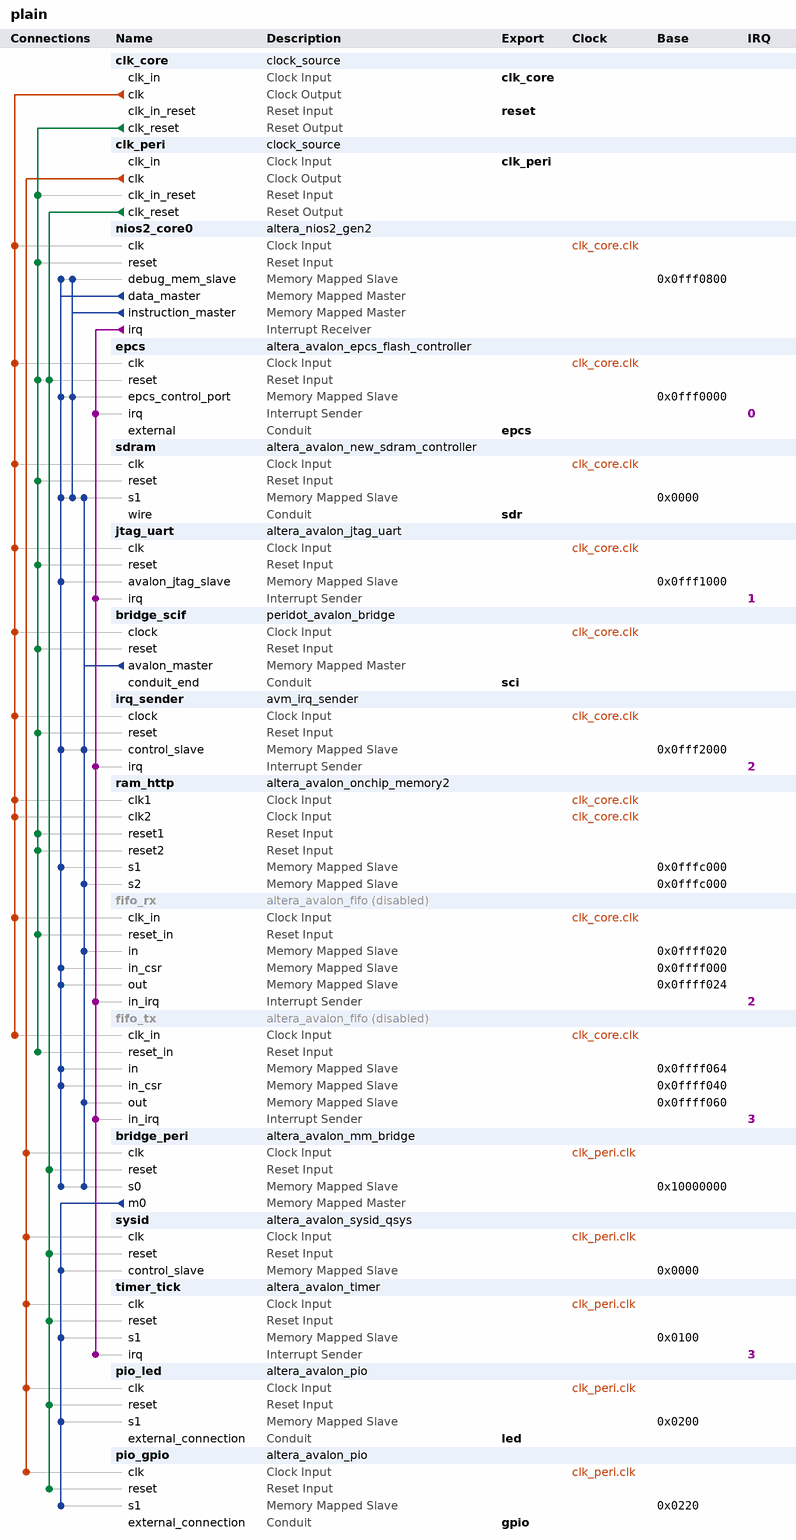
[diagram p0: system contents]
# Platform Designer (Qsys) system plain, Cyclone IV E EP4CE6E22C8
# Parameters at their usual value, and those the tool derives, are not listed.
package require -exact qsys 14.1
create_system plain
set_project_property DEVICE_FAMILY {Cyclone IV E}
set_project_property DEVICE EP4CE6E22C8

add_instance clk_core clock_source 14.1
set_instance_parameter_value clk_core clockFrequency 100000000

add_instance clk_peri clock_source 14.1
set_instance_parameter_value clk_peri clockFrequency 40000000

add_instance nios2_core0 altera_nios2_gen2 14.1
set_instance_parameter_value nios2_core0 dcache_size 0
set_instance_parameter_value nios2_core0 exceptionSlave sdram.s1
set_instance_parameter_value nios2_core0 icache_size 8192
set_instance_parameter_value nios2_core0 impl Fast
set_instance_parameter_value nios2_core0 resetSlave epcs.epcs_control_port
set_instance_parameter_value nios2_core0 setting_activateTrace true
set_instance_parameter_value nios2_core0 setting_branchpredictiontype Static

add_instance epcs altera_avalon_epcs_flash_controller 14.1
set_instance_parameter_value epcs autoSelectASMIAtom false
set_instance_parameter_value epcs resetrequest_enabled true

add_instance sdram altera_avalon_new_sdram_controller 14.1
set_instance_parameter_value sdram TAC 6.0
set_instance_parameter_value sdram TRCD 20.0
set_instance_parameter_value sdram TRFC 67.5
set_instance_parameter_value sdram TRP 20.0
set_instance_parameter_value sdram TWR 15.0
set_instance_parameter_value sdram casLatency 2
set_instance_parameter_value sdram columnWidth 8
set_instance_parameter_value sdram dataWidth 16
set_instance_parameter_value sdram generateSimulationModel false
set_instance_parameter_value sdram initRefreshCommands 8
set_instance_parameter_value sdram model single_Micron_MT48LC4M32B2_7_chip
set_instance_parameter_value sdram numberOfBanks 4
set_instance_parameter_value sdram numberOfChipSelects 1
set_instance_parameter_value sdram powerUpDelay 200.0
set_instance_parameter_value sdram refreshPeriod 15.625
set_instance_parameter_value sdram rowWidth 12

add_instance jtag_uart altera_avalon_jtag_uart 14.1
set_instance_parameter_value jtag_uart simInteractiveOptions NO_INTERACTIVE_WINDOWS

add_instance bridge_scif peridot_avalon_bridge 0.9

add_instance irq_sender avm_irq_sender 1.0
set_instance_parameter_value irq_sender IRQ_WIDTH 1

add_instance ram_http altera_avalon_onchip_memory2 14.1
set_instance_parameter_value ram_http dataWidth 32
set_instance_parameter_value ram_http dualPort true
set_instance_parameter_value ram_http initMemContent false
set_instance_parameter_value ram_http initializationFileName onchip_mem.hex
set_instance_parameter_value ram_http memorySize 2048
set_instance_parameter_value ram_http resetrequest_enabled false

add_instance fifo_rx altera_avalon_fifo 14.1
set_instance_property fifo_rx ENABLED false
set_instance_parameter_value fifo_rx bitsPerSymbol 16
set_instance_parameter_value fifo_rx channelWidth 8
set_instance_parameter_value fifo_rx errorWidth 8
set_instance_parameter_value fifo_rx fifoDepth 256
set_instance_parameter_value fifo_rx fifoInputInterfaceOptions AVALONMM_WRITE
set_instance_parameter_value fifo_rx fifoOutputInterfaceOptions AVALONMM_READ
set_instance_parameter_value fifo_rx singleClockMode true
set_instance_parameter_value fifo_rx symbolsPerBeat 2
set_instance_parameter_value fifo_rx useIRQ true
set_instance_parameter_value fifo_rx usePacket true
set_instance_parameter_value fifo_rx useReadControl false

add_instance fifo_tx altera_avalon_fifo 14.1
set_instance_property fifo_tx ENABLED false
set_instance_parameter_value fifo_tx bitsPerSymbol 16
set_instance_parameter_value fifo_tx channelWidth 8
set_instance_parameter_value fifo_tx errorWidth 8
set_instance_parameter_value fifo_tx fifoDepth 256
set_instance_parameter_value fifo_tx fifoInputInterfaceOptions AVALONMM_WRITE
set_instance_parameter_value fifo_tx fifoOutputInterfaceOptions AVALONMM_READ
set_instance_parameter_value fifo_tx singleClockMode true
set_instance_parameter_value fifo_tx symbolsPerBeat 2
set_instance_parameter_value fifo_tx useIRQ true
set_instance_parameter_value fifo_tx usePacket true
set_instance_parameter_value fifo_tx useReadControl false

add_instance bridge_peri altera_avalon_mm_bridge 14.1
set_instance_parameter_value bridge_peri ADDRESS_UNITS SYMBOLS
set_instance_parameter_value bridge_peri ADDRESS_WIDTH 10
set_instance_parameter_value bridge_peri DATA_WIDTH 32
set_instance_parameter_value bridge_peri MAX_PENDING_RESPONSES 4
set_instance_parameter_value bridge_peri USE_AUTO_ADDRESS_WIDTH 1

add_instance sysid altera_avalon_sysid_qsys 14.1
set_instance_parameter_value sysid id 538185769

add_instance timer_tick altera_avalon_timer 14.1
set_instance_parameter_value timer_tick period 1
set_instance_parameter_value timer_tick periodUnits MSEC

add_instance pio_led altera_avalon_pio 14.1
set_instance_parameter_value pio_led bitModifyingOutReg true
set_instance_parameter_value pio_led direction Output
set_instance_parameter_value pio_led width 1

add_instance pio_gpio altera_avalon_pio 14.1
set_instance_parameter_value pio_gpio bitModifyingOutReg true
set_instance_parameter_value pio_gpio direction Bidir
set_instance_parameter_value pio_gpio width 28

# connections
add_connection clk_core.clk bridge_scif.clock clock
add_connection clk_core.clk epcs.clk clock
add_connection clk_core.clk fifo_rx.clk_in clock
add_connection clk_core.clk fifo_tx.clk_in clock
add_connection clk_core.clk irq_sender.clock clock
add_connection clk_core.clk jtag_uart.clk clock
add_connection clk_core.clk nios2_core0.clk clock
add_connection clk_core.clk ram_http.clk1 clock
add_connection clk_core.clk ram_http.clk2 clock
add_connection clk_core.clk sdram.clk clock
add_connection clk_peri.clk bridge_peri.clk clock
add_connection clk_peri.clk pio_gpio.clk clock
add_connection clk_peri.clk pio_led.clk clock
add_connection clk_peri.clk sysid.clk clock
add_connection clk_peri.clk timer_tick.clk clock
add_connection clk_core.clk_reset bridge_scif.reset reset
add_connection clk_core.clk_reset clk_peri.clk_in_reset reset
add_connection clk_core.clk_reset epcs.reset reset
add_connection clk_core.clk_reset fifo_rx.reset_in reset
add_connection clk_core.clk_reset fifo_tx.reset_in reset
add_connection clk_core.clk_reset irq_sender.reset reset
add_connection clk_core.clk_reset jtag_uart.reset reset
add_connection clk_core.clk_reset nios2_core0.reset reset
add_connection clk_core.clk_reset ram_http.reset1 reset
add_connection clk_core.clk_reset ram_http.reset2 reset
add_connection clk_core.clk_reset sdram.reset reset
add_connection clk_peri.clk_reset bridge_peri.reset reset
add_connection clk_peri.clk_reset epcs.reset reset
add_connection clk_peri.clk_reset pio_gpio.reset reset
add_connection clk_peri.clk_reset pio_led.reset reset
add_connection clk_peri.clk_reset sysid.reset reset
add_connection clk_peri.clk_reset timer_tick.reset reset
add_connection bridge_peri.m0 pio_gpio.s1 avalon
set_connection_parameter_value bridge_peri.m0/pio_gpio.s1 baseAddress 0x0220
add_connection bridge_peri.m0 pio_led.s1 avalon
set_connection_parameter_value bridge_peri.m0/pio_led.s1 baseAddress 0x0200
add_connection bridge_peri.m0 sysid.control_slave avalon
set_connection_parameter_value bridge_peri.m0/sysid.control_slave baseAddress 0x0000
add_connection bridge_peri.m0 timer_tick.s1 avalon
set_connection_parameter_value bridge_peri.m0/timer_tick.s1 baseAddress 0x0100
add_connection bridge_scif.avalon_master bridge_peri.s0 avalon
set_connection_parameter_value bridge_scif.avalon_master/bridge_peri.s0 baseAddress 0x10000000
add_connection bridge_scif.avalon_master fifo_rx.in avalon
set_connection_parameter_value bridge_scif.avalon_master/fifo_rx.in baseAddress 0x0ffff020
add_connection bridge_scif.avalon_master fifo_tx.out avalon
set_connection_parameter_value bridge_scif.avalon_master/fifo_tx.out baseAddress 0x0ffff060
add_connection bridge_scif.avalon_master irq_sender.control_slave avalon
set_connection_parameter_value bridge_scif.avalon_master/irq_sender.control_slave baseAddress 0x0fff2000
add_connection bridge_scif.avalon_master ram_http.s2 avalon
set_connection_parameter_value bridge_scif.avalon_master/ram_http.s2 baseAddress 0x0fffc000
add_connection bridge_scif.avalon_master sdram.s1 avalon
set_connection_parameter_value bridge_scif.avalon_master/sdram.s1 baseAddress 0x0000
add_connection nios2_core0.data_master bridge_peri.s0 avalon
set_connection_parameter_value nios2_core0.data_master/bridge_peri.s0 baseAddress 0x10000000
add_connection nios2_core0.data_master epcs.epcs_control_port avalon
set_connection_parameter_value nios2_core0.data_master/epcs.epcs_control_port baseAddress 0x0fff0000
add_connection nios2_core0.data_master fifo_rx.in_csr avalon
set_connection_parameter_value nios2_core0.data_master/fifo_rx.in_csr baseAddress 0x0ffff000
add_connection nios2_core0.data_master fifo_rx.out avalon
set_connection_parameter_value nios2_core0.data_master/fifo_rx.out baseAddress 0x0ffff024
add_connection nios2_core0.data_master fifo_tx.in avalon
set_connection_parameter_value nios2_core0.data_master/fifo_tx.in baseAddress 0x0ffff064
add_connection nios2_core0.data_master fifo_tx.in_csr avalon
set_connection_parameter_value nios2_core0.data_master/fifo_tx.in_csr baseAddress 0x0ffff040
add_connection nios2_core0.data_master irq_sender.control_slave avalon
set_connection_parameter_value nios2_core0.data_master/irq_sender.control_slave baseAddress 0x0fff2000
add_connection nios2_core0.data_master jtag_uart.avalon_jtag_slave avalon
set_connection_parameter_value nios2_core0.data_master/jtag_uart.avalon_jtag_slave baseAddress 0x0fff1000
add_connection nios2_core0.data_master nios2_core0.debug_mem_slave avalon
set_connection_parameter_value nios2_core0.data_master/nios2_core0.debug_mem_slave baseAddress 0x0fff0800
add_connection nios2_core0.data_master ram_http.s1 avalon
set_connection_parameter_value nios2_core0.data_master/ram_http.s1 baseAddress 0x0fffc000
add_connection nios2_core0.data_master sdram.s1 avalon
set_connection_parameter_value nios2_core0.data_master/sdram.s1 baseAddress 0x0000
add_connection nios2_core0.instruction_master epcs.epcs_control_port avalon
set_connection_parameter_value nios2_core0.instruction_master/epcs.epcs_control_port baseAddress 0x0fff0000
add_connection nios2_core0.instruction_master nios2_core0.debug_mem_slave avalon
set_connection_parameter_value nios2_core0.instruction_master/nios2_core0.debug_mem_slave baseAddress 0x0fff0800
add_connection nios2_core0.instruction_master sdram.s1 avalon
set_connection_parameter_value nios2_core0.instruction_master/sdram.s1 baseAddress 0x0000
add_connection nios2_core0.irq epcs.irq interrupt
set_connection_parameter_value nios2_core0.irq/epcs.irq irqNumber 0
add_connection nios2_core0.irq fifo_rx.in_irq interrupt
set_connection_parameter_value nios2_core0.irq/fifo_rx.in_irq irqNumber 2
add_connection nios2_core0.irq fifo_tx.in_irq interrupt
set_connection_parameter_value nios2_core0.irq/fifo_tx.in_irq irqNumber 3
add_connection nios2_core0.irq irq_sender.irq interrupt
set_connection_parameter_value nios2_core0.irq/irq_sender.irq irqNumber 2
add_connection nios2_core0.irq jtag_uart.irq interrupt
set_connection_parameter_value nios2_core0.irq/jtag_uart.irq irqNumber 1
add_connection nios2_core0.irq timer_tick.irq interrupt
set_connection_parameter_value nios2_core0.irq/timer_tick.irq irqNumber 3

# exported interfaces
add_interface clk_core clock sink
set_interface_property clk_core EXPORT_OF clk_core.clk_in
add_interface clk_peri clock sink
set_interface_property clk_peri EXPORT_OF clk_peri.clk_in
add_interface epcs conduit end
set_interface_property epcs EXPORT_OF epcs.external
add_interface gpio conduit end
set_interface_property gpio EXPORT_OF pio_gpio.external_connection
add_interface led conduit end
set_interface_property led EXPORT_OF pio_led.external_connection
add_interface reset reset sink
set_interface_property reset EXPORT_OF clk_core.clk_in_reset
add_interface sci conduit end
set_interface_property sci EXPORT_OF bridge_scif.conduit_end
add_interface sdr conduit end
set_interface_property sdr EXPORT_OF sdram.wire

set_interconnect_requirement {$system} qsys_mm.clockCrossingAdapter HANDSHAKE
set_interconnect_requirement {$system} qsys_mm.insertDefaultSlave FALSE
set_interconnect_requirement {$system} qsys_mm.maxAdditionalLatency 1

save_system plain.qsys
